# Altium schematic sheet Power.SchDoc
size A4; SheetNumber: 2; SheetTotal: 11
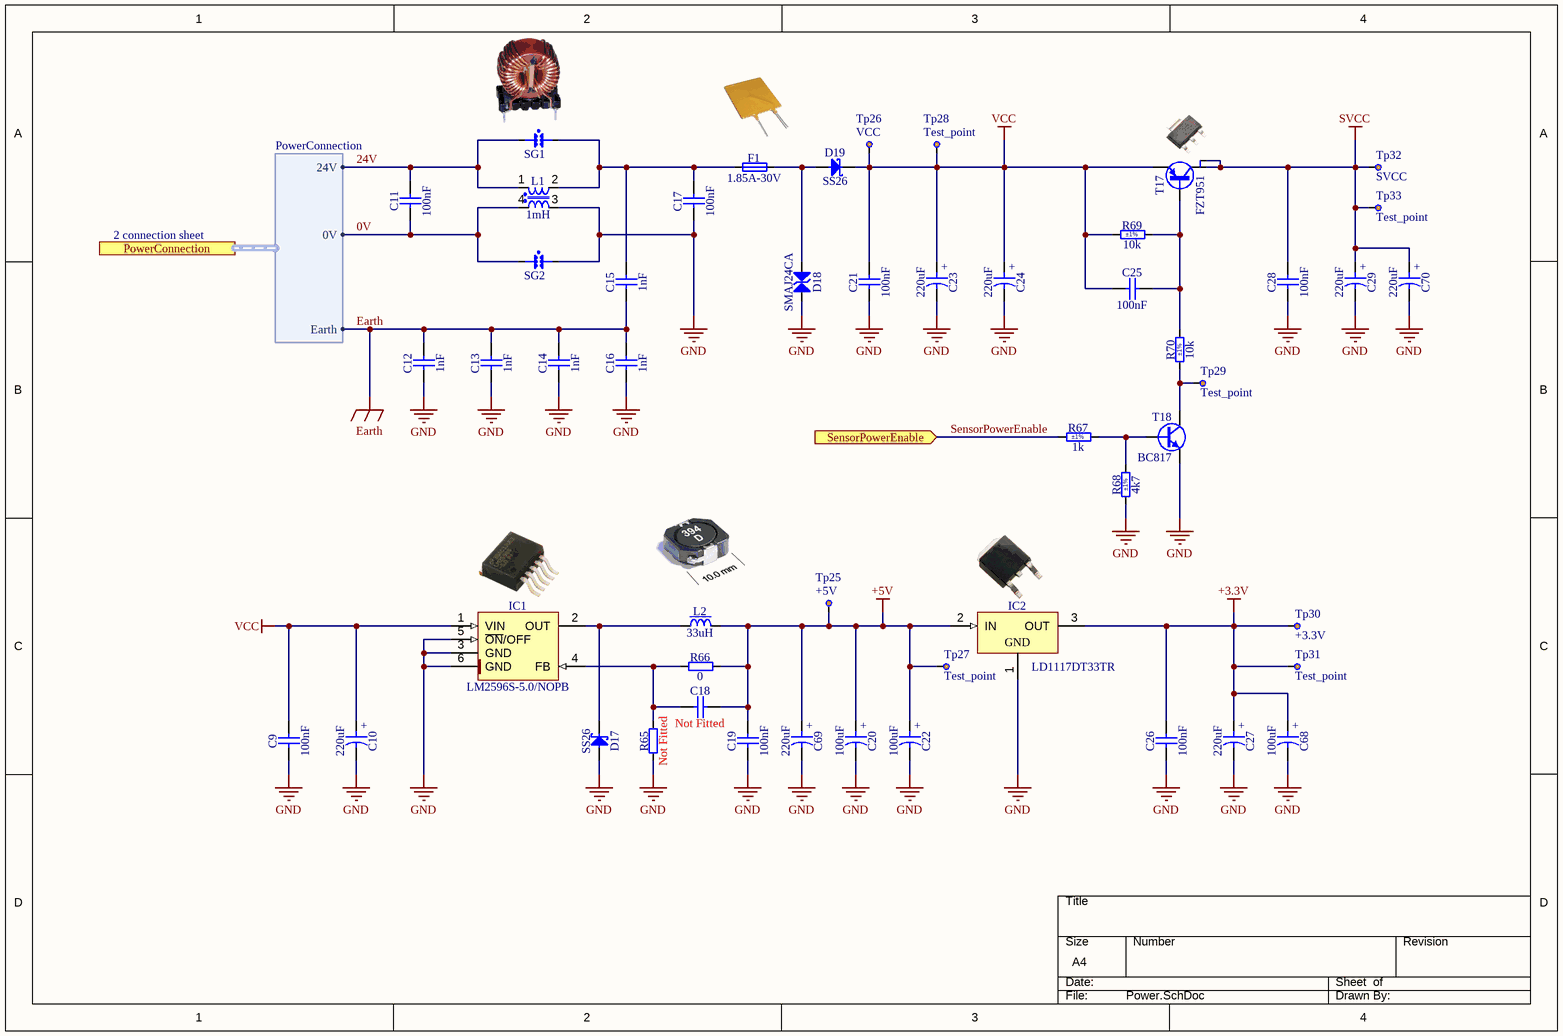
[diagram p0: Power.SchDoc]

## Parts
C9  100nF  [CAPC3216X140N]
C10  220uF  [CAPAE830X1020N]
C11  100nF  [CAPC3216X140N]
C12  1nF  [CAPC3216X94N]
C13  1nF  [CAPC3216X94N]
C14  1nF  [CAPC3216X94N]
C15  1nF  [CAPC3216X94N]
C16  1nF  [CAPC3216X94N]
C17  100nF  [CAPC3216X140N]
C18  Not Fitted  [CAPC2012X135N]
C19  100nF  [CAPC1608X87N]
C20  100uF  [CAPMP6032X280N]
C21  100nF  [CAPC3216X140N]
C22  100uF  [CAPMP6032X280N]
C23  220uF  [CAPAE830X1020N]
C24  220uF  [CAPAE830X1020N]
C25  100nF  [CAPC3216X140N]
C26  100nF  [CAPC1608X87N]
C27  220uF  [CAPAE830X1020N]
C28  100nF  [CAPC3216X140N]
C29  220uF  [CAPAE830X1020N]
C68  100uF  [CAPMP6032X280N]
C69  220uF  [CAPAE830X1020N]
C70  220uF  [CAPAE830X1020N]
D17  SS26  [DIOM5336X265N]
D18  SMAJ24CA  [DIOM5226X262N]
D19  SS26  [DIOM5336X265N]
F1  1.85A-30V  [FUSR_LITTELFUSE_RUEF185]
IC1  LM2596S-5.0/NOPB  [TO170P1435X465-6N-R1041X635]
IC2  LD1117DT33TR  [TO228P972X240-3N-R540X510]
L1  1mH  [IND_WURTH_WE-CMB-XS]
L2  33uH  [IND_COILCRAFT_MSS1038]
R65  Not Fitted  [RESC2012X60N]
R66  0  [RESC1608X55N]
R67  1k  Tolerance: ±1%  [RESC1608X55N]
R68  4k7  Tolerance: ±1%  [RESC1608X55N]
R69  10k  Tolerance: ±1%  [RESC3216X65N]
R70  10k  Tolerance: ±1%  [RESC3216X65N]
SG1  Spark Gap  [PCB_SPARK_GAP]  (value not drawn)
SG2  Spark Gap  [PCB_SPARK_GAP]  (value not drawn)
T17  FZT951  [SOT230P700X180-4N]
T18  BC817  [SOT95P230X110-3N]
Tp25  +5V  [TP_C40]
Tp26  VCC  [TP_C40]
Tp27  Test_point  [TP_C40]
Tp28  Test_point  [TP_C40]
Tp29  Test_point  [TP_C40]
Tp30  +3.3V  [TP_C40]
Tp31  Test_point  [TP_C40]
Tp32  SVCC  [TP_C40]
Tp33  Test_point  [TP_C40]

## Ports
PowerConnection (harness PowerConnection), SensorPowerEnable (in)

## Harnesses
PowerConnection: 24V, 0V, Earth

## Nets
+3.3V: C26.2 C27.1 C68.1 IC2.3(OUT) Tp30.1 Tp31.1
+5V: C18.2 C19.2 C20.1 C22.1 C69.1 IC2.2(IN) L2.2 R66.2 Tp25.1 Tp27.1
Earth: C12.2 C13.2 C14.2 C15.1 C16.2 ; port PowerConnection.Earth
GND: C9.1 C10.2 C12.1 C13.1 C14.1 C16.1 C17.1 C19.1 C20.2 C21.1 C22.2 C23.2 C24.2 C26.1 C27.2 C28.1 C29.2 C68.2 C69.2 C70.2 D17.2(A) D18.2 IC1.3(GND) IC1.5(~{ON}/OFF) IC1.6(GND) IC2.1(GND) L1.3 R65.1 R68.1 SG2.2 T18.2(E)
SVCC: C28.2 C29.1 C70.1 T17.2(C) T17.4(C) Tp32.1 Tp33.1
VCC: C9.2 C10.1 C21.2 C23.1 C24.1 C25.1 D19.1(C) IC1.1(VIN) R69.1 T17.3(E) Tp26.1 Tp28.1
0V: C11.1 L1.4 SG2.1 ; port PowerConnection.0V
24V: C11.2 L1.1 SG1.1 ; port PowerConnection.24V
SensorPowerEnable: R67.1 ; port SensorPowerEnable
NetC15_2: C15.2 C17.2 F1.1 L1.2 SG1.2
NetC18_1: C18.1 IC1.4(FB) R65.2 R66.1
NetC25_2: C25.2 R69.2 R70.2 T17.1(B)
NetD17_1: D17.1(C) IC1.2(OUT) L2.1
NetD18_1: D18.1 D19.2(A) F1.2
NetR67_2: R67.2 R68.2 T18.1(B)
NetR70_1: R70.1 T18.3(C) Tp29.1

## Notes on the sheet
- 2 connection sheet
- THIS DOCUMENT AND THE DATA DISCLOSED HEREIN OR
- HEREWITH IS THE PROPERTY OF ALTIUM LIMITED AND MAY
- DWG NO:
- REVISION
- REV:
- DESCRIPTION
- DATE
- APPROVED
- BE FREELY DISTRIBUTED IN WHOLE. NO RIGHTS ARE
- RESERVED OR EXPRESS OR IMPLIED WARANTEE GIVEN.
- ENG:
- APPROVALS
- PROJECT
- DSN:
- CHK:
- REFERENCE DOCUMENTS
- PROJECT REVISION:
- TITLE
- DOCUMENT REVISION:
- DESIGN ITEM:
- BOM:
- FAB DWG:
- PCB DWG:
- ASSY DWG:
- SCALE:
- A3
- SIZE
- CAGE CODE
- FILE NAME
- DWG NO.
- SHEET
- OF
- REV
- (in symbol CAE830-1020_220UF_50V_20%) +
- (in symbol CTE6032-28_100UF_16V_10%) +

## Library data of the parts
C9 C11 C17 C21 C25 C28 = CC1206_100NF_100V_10%_X7R: Non-polarised capacitor; Part Description: SMD Multilayer Chip Ceramic Capacitor; Manufacturer: GENERIC; Manufacturer1 Part Number: 222260115649; Voltage: 100V; TC: X7R; Tolerance: ±10%; Part Number: CC1206_100NF_100V_10%_X7R; Component Kind: Standard; Component Type: Standard; Pin Count: 2; Value: 100nF; Status: Preferred; Manufacturer Part Number: CC1206_100NF_100V_10%_X7R; Case: 1206; Mounted: Yes; Socket: No; SMD: Yes; Sense: No; Manufacturer1 Example: PHYCOMP; Manufacturer1 ComponentHeight: 1.25mm; HelpURL: \\cern.ch\dfs\Applications\Altium\Datasheets\CC1206_X7R_PHYCOMP.pdf; Author: CERN DEM JLC; CreateDate: 24.08.2009; LatestRevisionDate: 24.08.2009
C10 C23 C24 C27 C29 C69 C70 = CAE830-1020_220UF_50V_20%: Polarised capacitor; Part Description: Aluminum Electrolytic SMT Capacitor; Manufacturer: PANASONIC; Manufacturer Part Number: EEEFT1H221AP; Voltage: 50V; Tolerance: ±20%; Part Number: CAE830-1020_220UF_50V_20%; Component Kind: Standard; Component Type: Standard; Pin Count: 2; Value: 220uF; Status: Not Recommended; Case: F; Mounted: Yes; Socket: No; SMD: Yes; Sense: No; ComponentHeight: 10.2mm; HelpURL: \\cern.ch\dfs\Applications\Altium\Datasheets\CAE_PANASONIC_FT.pdf; Author: CERN DEM BC; CreateDate: 12.04.2021; LatestRevisionDate: 12.04.2021
C12-C16 = CC1206_1NF_200V_10%_X7R: Non-polarised capacitor; Part Description: SMD Multilayer Chip Ceramic Capacitor; Manufacturer: GENERIC; Manufacturer1 Part Number: 12062C102KAT2A; Voltage: 200V; TC: X7R; Tolerance: ±10%; Part Number: CC1206_1NF_200V_10%_X7R; Component Kind: Standard; Component Type: Standard; Pin Count: 2; Value: 1nF; Status: None; Manufacturer Part Number: CC1206_1NF_200V_10%_X7R; Case: 1206; Mounted: Yes; Socket: No; SMD: Yes; Sense: No; Manufacturer1 Example: AVX; Manufacturer1 ComponentHeight: 0.94mm; HelpURL: \\cern.ch\dfs\Applications\Altium\Datasheets\CC1206_X7R_AVX.pdf; Author: CERN DEM JLC; CreateDate: 05.03.2015; LatestRevisionDate: 05.03.2015
C18 = CC0805_NO-VALUE: Non-polarised capacitor; Part Description: Reserved Footprint For 0805(2012) Chip Ceramic Capacitor; Value: Undefined; Mounted: No; Part Number: CC0805_NO-VALUE; Component Kind: Standard; Component Type: Standard; Pin Count: 2; Status: None; Manufacturer: Undefined; Manufacturer Part Number: CC0805_NO-VALUE; Case: 0805; Socket: No; SMD: Yes; Sense: No; Manufacturer1 ComponentHeight: 1.35mm; HelpURL: Undefined; Author: CERN DEM JLC; CreateDate: 10.12.2008; LatestRevisionDate: 11.09.2013
C19 C26 = CC0603_100NF_50V_10%_X7R: Non-polarised capacitor; Part Description: SMD Multilayer Chip Ceramic Capacitor; Manufacturer: GENERIC; Manufacturer1 Part Number: 223858615649; Voltage: 50V; TC: X7R; Tolerance: ±10%; Part Number: CC0603_100NF_50V_10%_X7R; Component Kind: Standard; Component Type: Standard; Pin Count: 2; Value: 100nF; Status: Preferred; Manufacturer Part Number: CC0603_100NF_50V_10%_X7R; Case: 0603; Mounted: Yes; Socket: No; SMD: Yes; Sense: No; Manufacturer1 Example: PHYCOMP; Manufacturer1 ComponentHeight: 0.87mm; HelpURL: \\cern.ch\dfs\Applications\Altium\Datasheets\CC0603_X7R_PHYCOMP.pdf; Author: CERN DEM JLC; CreateDate: 03.12.2007; LatestRevisionDate: 03.12.2007
C20 C22 C68 = CTE6032-28_100UF_16V_10%: Polarised capacitor; Part Description: Solid Tantalum Chip Capacitor; Manufacturer: GENERIC; Manufacturer1 Part Number: TAJC107K016RNJ; Voltage: 16V; Tolerance: ±10%; Part Number: CTE6032-28_100UF_16V_10%; Component Kind: Standard; Component Type: Standard; Pin Count: 2; Value: 100uF; Status: Preferred; Manufacturer Part Number: CTE6032-28_100UF_16V_10%; Case: C; Mounted: Yes; Socket: No; SMD: Yes; Sense: No; Manufacturer1 Example: AVX; Manufacturer1 ComponentHeight: 2.8mm; HelpURL: \\cern.ch\dfs\Applications\Altium\Datasheets\CTE_AVX_TAJ.pdf; Author: CERN DEM JLC; CreateDate: 16.12.2013; LatestRevisionDate: 14.04.2021
D17 D19 = SS26: Schottky Diode; Part Description: Schottky Rectifier; Manufacturer: FAIRCHILD SEMICONDUCTOR; Voltage: 60V; Power: 2A; PressFit: No; Bonding: No; Part Number: SS26; Component Kind: Standard; Component Type: Standard; Device: SS26; PackageDescription: DO-214-AA/SMB Diode, Molded Body; 5.34mm L X 3.625mm W X 2.65mm H, IPC Medium Density; Manufacturer Part Number: SS26; Pin Count: 2; Case: DO-214AA; Mounted: Yes; Socket: No; SMD: Yes; Sense: No; ComponentHeight: 2.65mm; HelpURL: \\cern.ch\dfs\Applications\Altium\Datasheets\SS26.pdf; Author: CERN DEM JMW; CreateDate: 10.07.2015; LatestRevisionDate: 10.07.2015
D18 = SMAJ24CA: Transient Voltage Suppressor Diode (Bi-Directional); Part Description: Surface Mount Bi-directional Transient Voltage Suppressor Diode; Manufacturer: BOURNS; Voltage: 24V; Power: 400W; PressFit: No; Bonding: No; Part Number: SMAJ24CA; Component Kind: Standard; Component Type: Standard; Device: SMAJ24CA; PackageDescription: DO-214-AC/SMA Diode, Molded Body; 5.21mm L X 2.605mm W X 2.62mm H, IPC Medium Density; Manufacturer Part Number: SMAJ24CA; Pin Count: 2; Case: DO-214AC; Mounted: Yes; Socket: No; SMD: Yes; Sense: No; ComponentHeight: 2.62mm; HelpURL: \\cern.ch\dfs\Applications\Altium\Datasheets\SMAJ24CA.pdf; Author: CERN DEM JLC; CreateDate: 06.07.2011; LatestRevisionDate: 06.07.2011
F1 = FUSR_LITTELFUSE_RUEF185: Fuse; Part Description: Radial-Leaded PolySwitch® PPTC Resettable Fuse; PressFit: No; Part Number: FUSR_LITTELFUSE_RUEF185; Component Kind: Standard; Component Type: Standard; Pin Count: 2; PackageDescription: Radial-Leaded PolySwitch® PPTC Resettable Fuse, Body 10.2 x 3.00mm, RUEF Series; Family: Fuses Resettable; Mounted: Yes; Socket: No; SMD: No; Sense: No; Value: 1.85A-30V; Manufacturer: LITTELFUSE; Manufacturer Part Number: RUEF185; ComponentHeight: 15.7mm; HelpURL: \\cern.ch\dfs\Applications\Altium\Datasheets\FUSR_LITTELFUSE_RUEF.pdf; Author: CERN DEM BC; CreateDate: 09.04.2021; LatestRevisionDate: 09.04.2021
IC1 = LM2596S-5.0/NOPB: SIMPLE SWITCHER® Power Converter 150kHz, 3A Step-Down Voltage Regulator; Part Description: 4.5V to 40V Input to 5V Output, SIMPLE SWITCHER® Power Converter 150kHz, 3A Step-Down Voltage Regulator; Manufacturer: TEXAS INSTRUMENTS; PressFit: No; Bonding: No; Part Number: LM2596S-5.0/NOPB; Component Kind: Standard; Component Type: Standard; Device: LM2596S-5.0/NOPB; PackageDescription: D2PAK TO-263, TO, 1.70mm Pitch; 5 Pin, 14.35mm L X 8.64mm W X 4.65mm H body IPC Medium Density; Manufacturer Part Number: LM2596S-5.0/NOPB; Pin Count: 6; Case: TO-263-5; Mounted: Yes; Socket: No; SMD: Yes; Sense: No; ComponentHeight: 4.65mm; HelpURL: \\cern.ch\dfs\Applications\Altium\Datasheets\LM2596S-5.0-NOPB.pdf; Author: CERN DEM JLC; CreateDate: 19.12.2018; LatestRevisionDate: 19.12.2018
IC2 = LD1117DT33TR: 3-Terminal Regulator 1=GND 2=IN 3=OUT; Part Description: 3.3V 800mA Low drop fixed and adjustable positive voltage regulators; Manufacturer: ST MICROELECTRONICS; PressFit: No; Bonding: No; Part Number: LD1117DT33TR; Component Kind: Standard; Component Type: Standard; Device: LD1117DT33TR; PackageDescription: TO-252 DPAK TO, 2.28mm Pitch; 2 Pin, 9.725mm L X 6.10mm W X 2.40mm H body, IPC Medium Density; Manufacturer Part Number: LD1117DT33TR; Pin Count: 3; Case: DPAK; Mounted: Yes; Socket: No; SMD: Yes; Sense: No; ComponentHeight: 2.4mm; HelpURL: \\cern.ch\dfs\Applications\Altium\Datasheets\LD1117DT33TR.pdf; Author: CERN DEM JLC; CreateDate: 02.09.2009; LatestRevisionDate: 21.09.2009
L1 = IND_1MH_30%_WURTH_WE-CMB-XS: Inductor Common Mode; Part Description: Common Mode Power Choke WE-CMB Series Type XS; Manufacturer: WURTH ELEKTRONIK; Manufacturer Part Number: 744821201; Power: 2A; Resistance: 0.045R; Tolerance: ±30%; Part Number: IND_1MH_30%_WURTH_WE-CMB-XS; Component Kind: Standard; Component Type: Standard; Pin Count: 4; Value: 1mH; Mounted: Yes; Socket: No; SMD: No; Sense: No; ComponentHeight: 18mm; HelpURL: \\cern.ch\dfs\Applications\Altium\Datasheets\IND_WURTH_WE-CMB_744821201.pdf; Author: CERN DEM JLC; CreateDate: 03.09.2012; LatestRevisionDate: 03.09.2012
L2 = IND_33UH_20%_COILCRAFT_MSS1038: Inductor With Core; Part Description: SMT Power Inductor; Manufacturer Part Number: MSS1038-333ML; Power: 1.6A; Resistance: 0.093R; Tolerance: ±20%; Part Number: IND_33UH_20%_COILCRAFT_MSS1038; Component Kind: Standard; Component Type: Standard; Pin Count: 2; Value: 33uH; Manufacturer: COILCRAFT; Mounted: Yes; Socket: No; SMD: Yes; Sense: No; ComponentHeight: 4.0mm; HelpURL: \\cern.ch\dfs\Applications\Altium\Datasheets\IND_COILCRAFT_MSS1038.pdf; Author: CERN DEM JLC; CreateDate: 09.12.2009; LatestRevisionDate: 09.12.2009
R65 = R0805_NO-VALUE: Resistor; Part Description: Reserved Footprint For a 0805 (2012) Chip Resistor; Value: Undefined; PressFit: No; Mounted: No; Part Number: R0805_NO-VALUE; Component Kind: Standard; Component Type: Standard; Pin Count: 2; Status: None; Manufacturer: Undefined; Manufacturer Part Number: R0805_NO-VALUE; Case: 0805; Sense: No; Socket: No; SMD: Yes; Manufacturer1 Example: Undefined; Manufacturer1 Part Number: Undefined; Manufacturer1 ComponentHeight: Undefined; HelpURL: Undefined; Author: CERN DEM JLC; CreateDate: 03.12.2007; LatestRevisionDate: 13.03.2008
R66 = R0603_0R_JUMPER: Resistor; Part Description: 1A (0.05R Max DC Resistance) Zero Ohm Jumper; Manufacturer: GENERIC; Manufacturer1 Part Number: NRC06Z0; PressFit: No; Part Number: R0603_0R_JUMPER; Component Kind: Standard; Component Type: Standard; Pin Count: 2; Value: 0; Status: Preferred; Manufacturer Part Number: R0603_0R_JUMPER; Case: 0603; Mounted: Yes; Sense: No; Socket: No; SMD: Yes; Manufacturer1 Example: NIC COMPONENT; Manufacturer1 ComponentHeight: 0.55mm; HelpURL: \\cern.ch\dfs\Applications\Altium\Datasheets\R0603_NIC_NRC.pdf; Author: CERN DEM JLC; CreateDate: 03.12.2007; LatestRevisionDate: 13.03.2008
R67 = R0603_1K_1%_0.1W_100PPM: Resistor - 1%; Part Description: General Purpose Thick Film Chip Resistor; Manufacturer: GENERIC; Manufacturer1 Part Number: NRC06F1001TRF; Power: 0.1W; TC: ±100ppm/°C; PressFit: No; Part Number: R0603_1K_1%_0.1W_100PPM; Component Kind: Standard; Component Type: Standard; Pin Count: 2; Value: 1k; Status: Preferred; Manufacturer Part Number: R0603_1K_1%_0.1W_100PPM; Case: 0603; Mounted: Yes; Sense: No; Socket: No; SMD: Yes; Manufacturer1 Example: NIC COMPONENT; Manufacturer1 ComponentHeight: 0.55mm; HelpURL: \\cern.ch\dfs\Applications\Altium\Datasheets\R0603_NIC_NRC.pdf; Author: CERN DEM JLC; CreateDate: 03.12.2007; LatestRevisionDate: 13.03.2008
R68 = R0603_4K7_1%_0.1W_100PPM: Resistor - 1%; Part Description: General Purpose Thick Film Chip Resistor; Manufacturer: GENERIC; Manufacturer1 Part Number: NRC06F4701TRF; Power: 0.1W; TC: ±100ppm/°C; PressFit: No; Part Number: R0603_4K7_1%_0.1W_100PPM; Component Kind: Standard; Component Type: Standard; Pin Count: 2; Value: 4k7; Status: Preferred; Manufacturer Part Number: R0603_4K7_1%_0.1W_100PPM; Case: 0603; Mounted: Yes; Sense: No; Socket: No; SMD: Yes; Manufacturer1 Example: NIC COMPONENT; Manufacturer1 ComponentHeight: 0.55mm; HelpURL: \\cern.ch\dfs\Applications\Altium\Datasheets\R0603_NIC_NRC.pdf; Author: CERN DEM JLC; CreateDate: 03.12.2007; LatestRevisionDate: 13.03.2008
R69 R70 = R1206_10K_1%_0.25W_100PPM: Resistor - 1%; Part Description: General Purpose Thick Film Chip Resistor; Manufacturer: GENERIC; Manufacturer1 Part Number: NRC12F1002TRF; Power: 0.25W; TC: ±100ppm/°C; PressFit: No; Part Number: R1206_10K_1%_0.25W_100PPM; Component Kind: Standard; Component Type: Standard; Pin Count: 2; Value: 10k; Status: Preferred; Manufacturer Part Number: R1206_10K_1%_0.25W_100PPM; Case: 1206; Mounted: Yes; Sense: No; Socket: No; SMD: Yes; Manufacturer1 Example: NIC COMPONENT; Manufacturer1 ComponentHeight: 0.65mm; HelpURL: \\cern.ch\dfs\Applications\Altium\Datasheets\R1206_NIC_NRC.pdf; Author: CERN DEM JLC; CreateDate: 03.12.2007; LatestRevisionDate: 13.03.2008
SG1 SG2 = SparkGap: PCB Spark Gap
T17 = FZT951: PNP Transistor; Part Description: 60V 5A PNP Silicon Planar High Current Transistor; Manufacturer: ZETEX SEMICONDUCTORS; PressFit: No; Bonding: No; Part Number: FZT951; Component Kind: Standard; Component Type: Standard; Device: FZT951; PackageDescription: SOT223, 2.30mm Pitch; 4 Pin, 3.70mm W X 6.70mm L X 1.80mm H body, IPC Medium Density; Manufacturer Part Number: FZT951; Pin Count: 4; Case: SOT223; Mounted: Yes; Socket: No; SMD: Yes; Sense: No; ComponentHeight: 1.8mm; HelpURL: \\cern.ch\dfs\Applications\Altium\Datasheets\FZT951.pdf; Author: CERN DEM JLC; CreateDate: 16.07.2008; LatestRevisionDate: 16.07.2008
T18 = BC817: NPN Transistor; Part Description: 45V 500mA NPN General-Purpose Transistor; Manufacturer: NXP SEMICONDUCTORS; PressFit: No; Bonding: No; Part Number: BC817; Component Kind: Standard; Component Type: Standard; Device: BC817; PackageDescription: SOT23, 0.95mm Pitch; 3 Pin, 1.30mm W X 2.90mm L X 1.10mm H body, IPC Medium Density; Manufacturer Part Number: BC817; Pin Count: 3; Case: SOT23-3; Mounted: Yes; Socket: No; SMD: Yes; Sense: No; ComponentHeight: 1.1mm; HelpURL: \\cern.ch\dfs\Applications\Altium\Datasheets\BC817.pdf; Author: CERN DEM JLC; CreateDate: 12.05.2011; LatestRevisionDate: 12.05.2011
Tp25-Tp33 = Test point: Published: 8-Jun-2000; LatestRevisionDate: 17-Jul-2002; LatestRevisionNote: Re-released for DXP Platform.; PackageReference: AXIAL-0.3; Publisher: Altium Limited